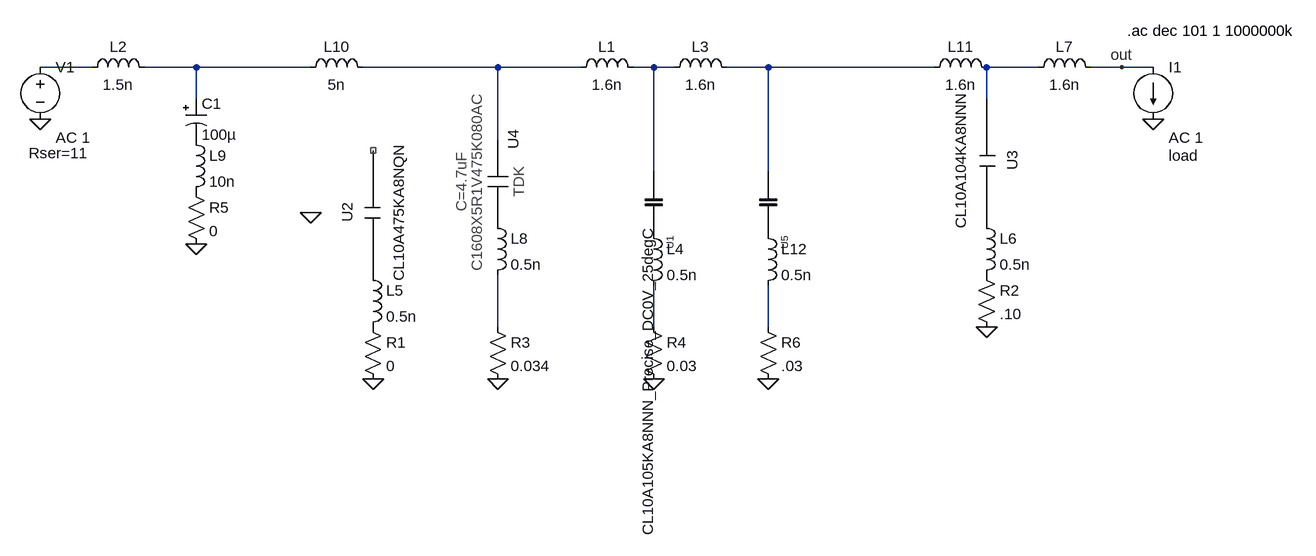
[diagram p0: schematic pdn.asc]
pdn.asc, the LTspice schematic file:
Version 4
SHEET 1 1596 1204
WIRE -272 144 -352 144
WIRE -112 144 -192 144
WIRE 64 144 -112 144
WIRE 352 144 144 144
WIRE 480 144 352 144
WIRE 592 144 560 144
WIRE 624 144 592 144
WIRE 768 144 704 144
WIRE 1024 144 768 144
WIRE 1184 144 1104 144
WIRE 1312 144 1264 144
WIRE 1360 144 1312 144
WIRE -112 192 -112 144
WIRE 1104 192 1104 144
WIRE 352 256 352 144
WIRE 592 304 592 144
WIRE 768 304 768 144
WIRE 352 544 352 464
WIRE 592 544 592 480
WIRE 768 544 768 480
FLAG -352 224 0
FLAG 160 624 0
FLAG 1104 544 0
FLAG 1360 224 0
FLAG 64 368 0
FLAG 352 624 0
FLAG 592 624 0
FLAG 1312 144 out
FLAG -112 416 0
FLAG 768 624 0
SYMBOL voltage -352 128 R0
WINDOW 123 24 124 Left 2
WINDOW 39 -18 148 Left 2
SYMATTR Value2 AC 1
SYMATTR SpiceLine Rser=11
SYMATTR InstName V1
SYMATTR Value ""
SYMBOL ind 464 160 R270
WINDOW 0 32 56 VTop 2
WINDOW 3 5 56 VBottom 2
SYMATTR InstName L1
SYMATTR Value 1.6n
SYMBOL ind -288 160 R270
WINDOW 0 32 56 VTop 2
WINDOW 3 5 56 VBottom 2
SYMATTR InstName L2
SYMATTR Value 1.5n
SYMBOL ind 608 160 R270
WINDOW 0 32 56 VTop 2
WINDOW 3 5 56 VBottom 2
SYMATTR InstName L3
SYMATTR Value 1.6n
SYMBOL ind 144 448 R0
SYMATTR InstName L5
SYMATTR Value 0.5n
SYMBOL ind 1088 368 R0
SYMATTR InstName L6
SYMATTR Value 0.5n
SYMBOL ind 576 384 R0
SYMATTR InstName L4
SYMATTR Value 0.5n
SYMBOL current 1360 144 R0
WINDOW 3 24 80 Invisible 2
WINDOW 123 24 108 Left 2
WINDOW 39 24 136 Left 2
SYMATTR Value ""
SYMATTR Value2 AC 1
SYMATTR SpiceLine load
SYMATTR InstName I1
SYMBOL CL10A105KA8NNN_Precise_DC0V_25degC_LT 592 352 R90
WINDOW 38 273 9 Center 2
SYMATTR InstName U1
SYMBOL res 1088 448 R0
SYMATTR InstName R2
SYMATTR Value .10
SYMBOL CL10A475KA8NQN_DC0V_25deg 160 368 R270
SYMATTR InstName U2
SYMBOL CL10A104KA8NNN_DC0V_25deg 1104 288 R90
SYMATTR InstName U3
SYMBOL ind 1168 160 R270
WINDOW 0 32 56 VTop 2
WINDOW 3 5 56 VBottom 2
SYMATTR InstName L7
SYMATTR Value 1.6n
SYMBOL ind 336 368 R0
SYMATTR InstName L8
SYMATTR Value 0.5n
SYMBOL C1608X5R1V475K080AC_b 352 320 R90
SYMATTR InstName U4
SYMBOL res 144 528 R0
SYMATTR InstName R1
SYMATTR Value 0
SYMBOL res 336 528 R0
SYMATTR InstName R3
SYMATTR Value 0.034
SYMBOL res 576 528 R0
SYMATTR InstName R4
SYMATTR Value 0.03
SYMBOL polcap -128 192 R0
WINDOW 3 24 56 Left 2
SYMATTR Value 100µ
SYMATTR InstName C1
SYMATTR Description Capacitor
SYMATTR Type cap
SYMATTR SpiceLine V=10 Irms=235m Rser=0.46 Lser=0 mfg="Panasonic" pn="ECA1AFQ101" type="Al electrolytic"
SYMBOL ind -128 240 R0
SYMATTR InstName L9
SYMATTR Value 10n
SYMBOL res -128 320 R0
SYMATTR InstName R5
SYMATTR Value 0
SYMBOL ind 48 160 R270
WINDOW 0 32 56 VTop 2
WINDOW 3 5 56 VBottom 2
SYMATTR InstName L10
SYMATTR Value 5n
SYMBOL ind 752 384 R0
SYMATTR InstName L12
SYMATTR Value 0.5n
SYMBOL CL10A105KA8NNN_Precise_DC0V_25degC_LT 768 352 R90
WINDOW 38 273 9 Invisible 2
SYMATTR InstName U5
SYMBOL res 752 528 R0
SYMATTR InstName R6
SYMATTR Value .03
SYMBOL ind 1008 160 R270
WINDOW 0 32 56 VTop 2
WINDOW 3 5 56 VBottom 2
SYMATTR InstName L11
SYMATTR Value 1.6n
TEXT 1320 88 Left 2 !.ac dec 101 1 1000000k

The netlist it stands for:
* pdn.asc
V1 N001 0 AC 1 Rser=11
L1 N003 N004 1.6n
L2 N001 N002 1.5n
L3 N004 N005 1.6n
L5 P001 P002 0.5n
L6 P003 P004 0.5n
L4 P005 N008 0.5n
I1 out 0 AC 1 load
XU1 P005 N004 CL10A105KA8NNN_Precise_DC0V_25degC  ; pins A B
R2 P004 0 .10
XU2 P001 NC_01 CL10A475KA8NQN
XU3 N006 P003 CL10A104KA8NNN
L7 N006 out 1.6n
L8 P006 N007 0.5n
XU4 N003 P006 C1608X5R1V475K080AC_b  ; pins 1 2
R1 P002 0 0
R3 N007 0 0.034
R4 N008 0 0.03
C1 N002 P007 100µ V=10 Irms=235m Rser=0.46 Lser=0 mfg="Panasonic" pn="ECA1AFQ101" type="Al electrolytic"
L9 P007 P008 10n
R5 P008 0 0
L10 N002 N003 5n
L12 P009 N009 0.5n
XU5 P009 N005 CL10A105KA8NNN_Precise_DC0V_25degC  ; pins A B
R6 N009 0 .03
L11 N005 N006 1.6n
.ac dec 101 1 1000000k
.lib CL10A105KA8NNN_Precise_DC0V_25degC_LT.mod
.lib CL10A475KA8NQN_DC0V_25deg.mod
.lib CL10A104KA8NNN_DC0V_25deg.mod
.lib C1608X5R1V475K080AC_b_LTspice.mod
.backanno
.end